# EasyEDA Pro project ProPrj_基于STM32的多功能串口分析仪_2025-03-12.epro, board PCB3
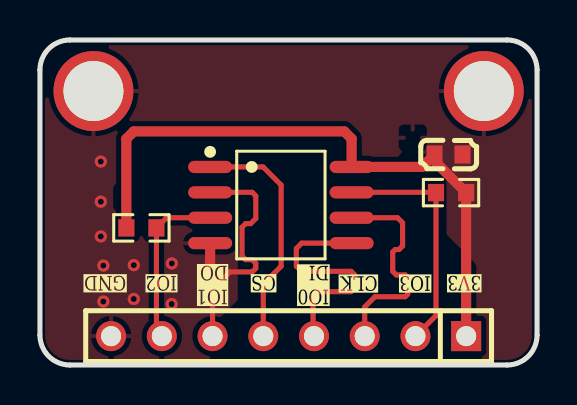
[diagram p11: board, top side]
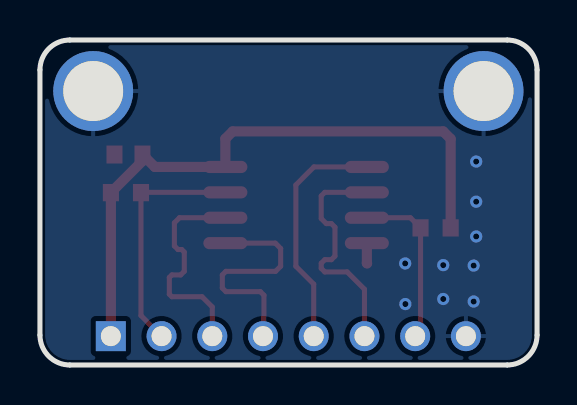
[diagram p12: board, bottom side, seen from below]

Outline 24.89 x 16.26 mm; copper layers: Top Layer, Bottom Layer. Coordinates in mm from the lower left corner of the outline.
Outline path: 0,14.76 arc(0.44,15.82) 1.5,16.26 23.39,16.26 arc(24.45,15.82) 24.89,14.76 24.89,1.5 arc(24.45,0.44) 23.39,0 1.5,0 arc(0.44,0.44) 0,1.5 0,14.76
Stack: Top Layer 0.035mm / Dielectric1 1.51mm FR4 er 4.5 / Bottom Layer 0.035mm

## Design rules (mm)
template: JLCPCB Capability(Two Layers Board)
spacing copperThickness1oz (default): track to track 0.102, other pairs 0.152 to 0.3
spacing copperThickness2oz: track to track 0.203, other pairs 0.152 to 0.3
track width copperThickness1oz (default): min 0.127, default 0.254, max 2.54
track width copperThickness2oz: min 0.203, default 0.254, max 2.54
differential pair differentialPair (default): width min 0.127, default 0.254, max 2.54; gap min 0.152, default 0.152
via viaSize (default): diameter min 0.5, default 0.61, max 10; hole min 0.3, default 0.305, max 6.3

## Placement (name value [footprint] x y rotation side)
C1  100nF  [C0603]  20.46 10.53 180 top
H1  -  [HDR-TH_8P-P2.54-V-M]  12.45 1.44 180 top
NOREF  -  [Pad_e12]  22.23 13.7 180 top
NOREF#2  -  [Pad_e7]  2.68 13.7 0 top
R1  10K  [R0603]  20.59 8.62 180 top
R3  10K  [R0603]  5.08 6.86 0 top
U21  GD25Q64ESIG  [SOP-8_L5.3-W5.3-P1.27-LS8.0-BL]  12.06 8 270 top

## Footprints (pads in the part's own frame, mm; a bottom-side part is the same pattern mirrored in y, then rotated)
C0603
  rect 0.8x0.9 smd: 1(-0.7,0) 2(0.7,0)
HDR-TH_8P-P2.54-V-M
  rect 1.5x1.5 hole 1: 1(-8.89,0)
  round 1.5 hole 1: 2(-6.35,0) 3(-3.81,0) 4(-1.27,0) 5(1.27,0) 6(3.81,0) 7(6.35,0) 8(8.89,0)
Pad_e7
  round 4 hole 3: 1(0,0)
Pad_e12
  round 4 hole 3: 1(0,0)
R0603
  rect 0.806x0.864 smd: 1(-0.753,0) 2(0.753,0)
SOP-8_L5.3-W5.3-P1.27-LS8.0-BL
  oval 0.609x2.204 smd: 1(-1.905,-3.542) 2(-0.635,-3.542) 3(0.635,-3.542) 4(1.905,-3.542) 5(1.905,3.542) 6(0.635,3.542) 7(-0.635,3.542) 8(-1.905,3.542)

## Nets
As in the schematic, except:
GND: C1.1 H1.8 NOREF.1 NOREF#2.1 U21.4

## Via types
v1: diameter 0.61, hole 0.305, Top Layer to Bottom Layer, 9 vias

## Routing (per net, layer and track width the routed paths; a pad name or vN(x,y) marks a point on that pad's centre or on a via; arc(x,y) is an arc through that point)
3.3V: length 31.6
  Top Layer w0.508: R3.1 4.33,11.31 4.7,11.68 15.24,11.68 15.61,11.32 15.61,9.91 19.14,9.91 19.76,10.53 19.76,10.2 R1.1 21.34,1.45 H1.1
GND: length 1
  Top Layer w0.508: 8.51,5.08 8.52,5.09 U21.4
  vias: v1(3.05,10.17) v1(3.05,8.17) v1(3.05,6.43) v1(3.17,4.97) v1(3.17,3.17) v1(4.7,4.99) v1(4.7,3.3) v1(6.6,5.08) v1(6.59,3.05)
CLK: length 11
  Top Layer w0.254: 15.61,7.37 17.91,7.37 18.16,7.11 18.16,5.96 17.98,5.78 17.79,5.78 17.66,5.65 17.66,4.69 17.84,4.51 18.29,4.51 18.41,4.38 18.41,3.54 18.29,3.42 16.78,3.42 16.26,2.9 H1.3
CS: length 11.9
  Top Layer w0.254: H1.5 11.18,4.04 12.08,4.94 12.08,9 11.17,9.91 U21.1
IO0: length 11.8
  Top Layer w0.254: H1.4 13.68,1.49 13.68,3.49 13.85,3.67 15.58,3.67 15.76,3.85 15.76,4.51 15.58,4.69 13.09,4.69 12.84,4.94 12.84,5.83 13.11,6.1 15.61,6.1
IO1: length 11.8
  Top Layer w0.254: H1.6 8.64,3.79 9.51,4.65 10.63,4.65 10.81,4.83 10.81,5.09 10.63,5.27 10.3,5.27 10.12,5.45 10.12,6.89 10.3,7.07 10.55,7.07 10.81,7.33 10.81,8.46 10.63,8.64 U21.2
IO2: length 8.4
  Top Layer w0.254: H1.7 5.83,1.71 R3.2 6.34,7.37 U21.3
IO3: length 11.8
  Top Layer w0.254: H1.2 19.83,2.47 R1.2 19.82,8.64 15.61,8.64

## Copper pours and planes (outline as drawn; the poured copper is in the pictures)
GND on Top Layer: 25.03,-0.14 -0.12,-0.14 -0.12,16.37 25.03,16.37
GND on Bottom Layer: 25.03,-0.14 -0.12,-0.14 -0.12,16.37 25.03,16.37

## Text on the board
Top Silkscreen Layer: GND | IO2 | IO1 / DO | CS | IO0 / DI | CLK | IO3 | 3V3
